# Altium project Recorder_ESP32.PrjPCB
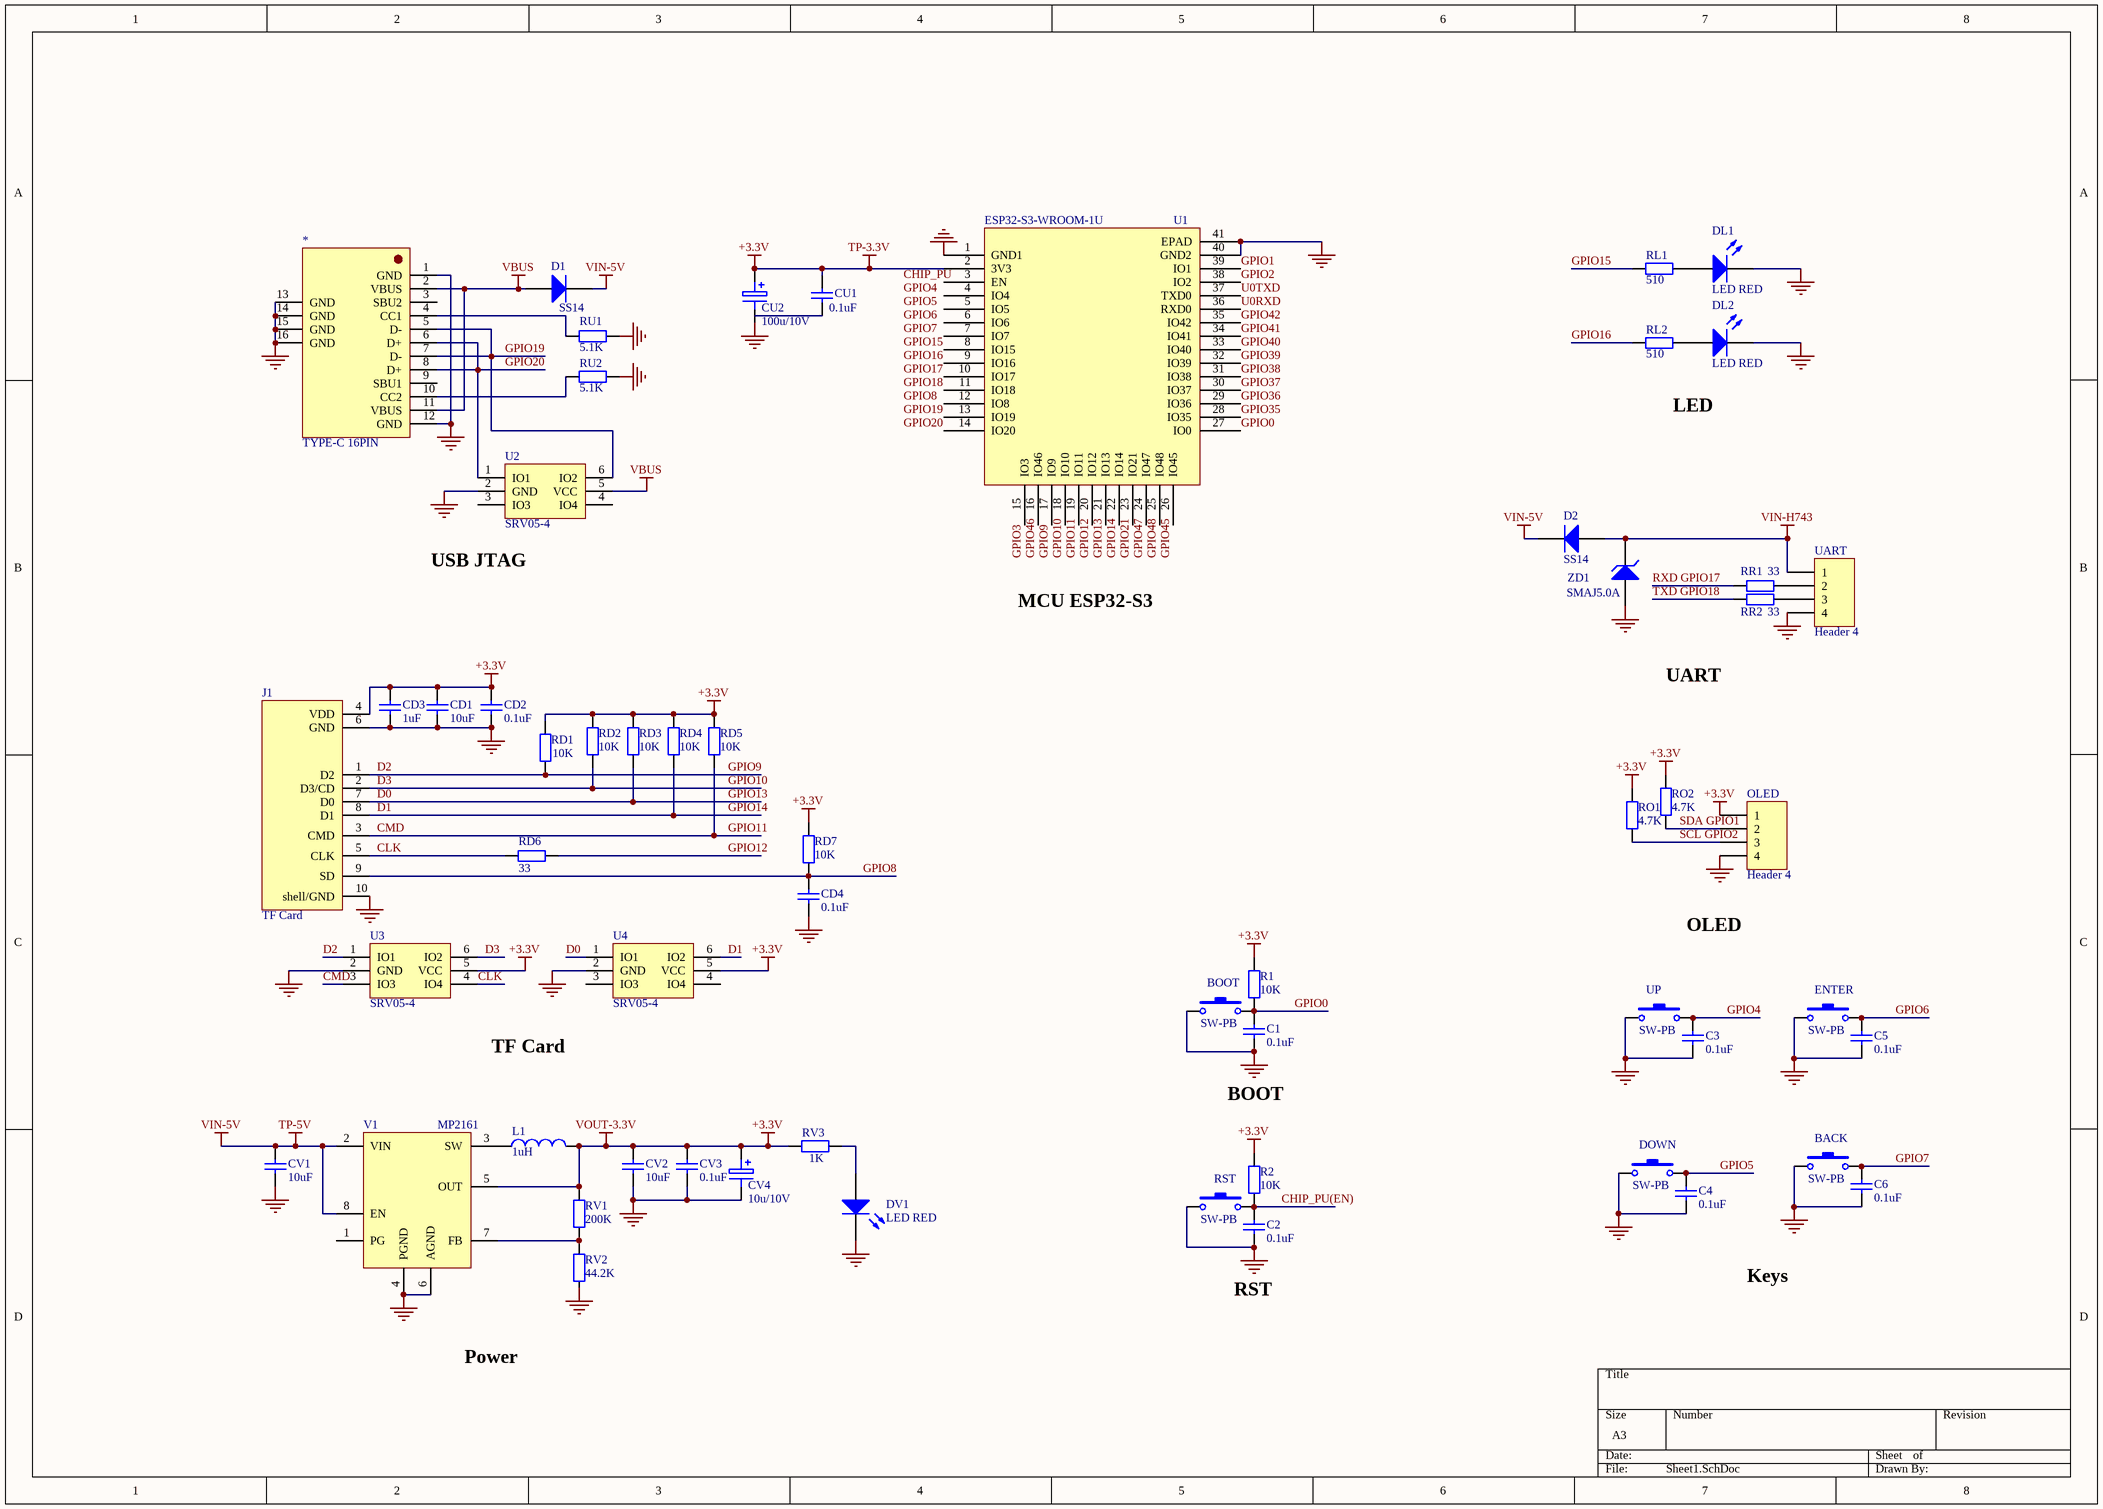
[diagram p0: Sheet1.SchDoc]
1 sheet, 58 parts. Net scope: global (net labels, ports and power ports of the same name join across sheets).
Board files: PCB1.PcbDoc, ZJ-20260608.PcbDoc

## Sheet Sheet1.SchDoc
size A3

### Parts
*  TYPE-C 16PIN
BACK  SW-PB  [SPST-2]
BOOT  SW-PB  [SPST-2]
C1  value 0.1uF  [RAD-0.3]  (hidden comment: Cap)
C2  value 0.1uF  [RAD-0.3]  (hidden comment: Cap)
C3  value 0.1uF  [RAD-0.3]  (hidden comment: Cap)
C4  value 0.1uF  [RAD-0.3]  (hidden comment: Cap)
C5  value 0.1uF  [RAD-0.3]  (hidden comment: Cap)
C6  value 0.1uF  [RAD-0.3]  (hidden comment: Cap)
CD1  value 10uF  [RAD-0.3]  (hidden comment: Cap)
CD2  value 0.1uF  [RAD-0.3]  (hidden comment: Cap)
CD3  value 1uF  [RAD-0.3]  (hidden comment: Cap)
CD4  value 0.1uF  [RAD-0.3]  (hidden comment: Cap)
CU1  value 0.1uF  [RAD-0.3]  (hidden comment: Cap)
CU2  100u/10V
CV1  value 10uF  [RAD-0.3]  (hidden comment: Cap)
CV2  value 10uF  [RAD-0.3]  (hidden comment: Cap)
CV3  value 0.1uF  [RAD-0.3]  (hidden comment: Cap)
CV4  10u/10V
D1  SS14  [SMC]
D2  SS14  [SMC]
DL1  LED RED  [3.2X1.6X1.1]
DL2  LED RED  [3.2X1.6X1.1]
DOWN  SW-PB  [SPST-2]
DV1  LED RED  [3.2X1.6X1.1]
ENTER  SW-PB  [SPST-2]
ESP32-S3-WROOM-1U  U1
J1  TF Card
L1  value 1uH  [0402-A]  (hidden comment: Inductor)
OLED  Header 4  [HDR1X4]
R1  value 10K  [AXIAL-0.4]  (hidden comment: Res2)
R2  value 10K  [AXIAL-0.4]  (hidden comment: Res2)
RD1  value 10K  [AXIAL-0.4]  (hidden comment: Res2)
RD2  value 10K  [AXIAL-0.4]  (hidden comment: Res2)
RD3  value 10K  [AXIAL-0.4]  (hidden comment: Res2)
RD4  value 10K  [AXIAL-0.4]  (hidden comment: Res2)
RD5  value 10K  [AXIAL-0.4]  (hidden comment: Res2)
RD6  value 33  [AXIAL-0.4]  (hidden comment: Res2)
RD7  value 10K  [AXIAL-0.4]  (hidden comment: Res2)
RL1  510  [AXIAL-0.4]
RL2  510  [AXIAL-0.4]
RO1  value 4.7K  [AXIAL-0.4]  (hidden comment: Res2)
RO2  value 4.7K  [AXIAL-0.4]  (hidden comment: Res2)
RR1  value 33  [AXIAL-0.4]  (hidden comment: Res2)
RR2  value 33  [AXIAL-0.4]  (hidden comment: Res2)
RST  SW-PB  [SPST-2]
RU1  5.1K  [AXIAL-0.4]
RU2  5.1K  [AXIAL-0.4]
RV1  value 200K  [AXIAL-0.4]  (hidden comment: Res2)
RV2  value 44.2K  [AXIAL-0.4]  (hidden comment: Res2)
RV3  1K  [AXIAL-0.4]
U2  SRV05-4
U3  SRV05-4
U4  SRV05-4
UART  Header 4  [HDR1X4]
UP  SW-PB  [SPST-2]
V1  MP2161
ZD1  SMAJ5.0A  [DIODE-0.7]

### Nets
+3.3V: CD1.2 CD2.2 CD3.2 CU1.2 CU2.1 CV2.2 CV3.2 CV4.1 ESP32-S3-WROOM-1U.2(3V3) J1.4(VDD) L1.2 OLED.1 R1.2 R2.2 RD1.2 RD2.2 RD3.2 RD4.2 RD5.2 RD7.2 RO1.2 RO2.2 RV1.2 RV3.2 U3.5(VCC) U4.5(VCC) V1.5(OUT)  [also labelled TP-3.3V, VOUT-3.3V]
GND: *.1(GND) *.12(GND) *.13(GND) *.14(GND) *.15(GND) *.16(GND) BACK.1 BOOT.1 C1.1 C2.1 C3.1 C4.1 C5.1 C6.1 CD1.1 CD2.1 CD3.1 CD4.1 CU2.2 CV1.1 CV2.1 CV3.1 CV4.2 DL1.2(K) DL2.2(K) DOWN.1 DV1.2(K) ENTER.1 ESP32-S3-WROOM-1U.1(GND1) ESP32-S3-WROOM-1U.40(GND2) ESP32-S3-WROOM-1U.41(EPAD) J1.6(GND) J1.10(shell/GND) OLED.4 RST.1 RU1.1 RU2.1 U2.2(GND) U3.2(GND) U4.2(GND) UART.4 UP.1 V1.4(PGND) V1.6(AGND) ZD1.1(A)
TP-5V: CV1.2 D1.2(K) D2.2(K) V1.2(VIN) V1.8(EN)  [also labelled VIN-5V]
VBUS: *.2(VBUS) *.11(VBUS) D1.1(A) U2.5(VCC)
VIN-H743: D2.1(A) UART.1 ZD1.2(K)
CHIP_PU(EN): C2.2 R2.1 RST.2
CLK: J1.5(CLK) RD6.2 U3.4(IO4)
CMD: J1.3(CMD) RD5.1 U3.3(IO3)  [also labelled GPIO11]
D0: J1.7(D0) RD3.1 U4.1(IO1)  [also labelled GPIO13]
D1: J1.8(D1) RD4.1 U4.6(IO2)  [also labelled GPIO14]
D2: J1.1(D2) RD1.1 U3.1(IO1)  [also labelled GPIO9]
D3: J1.2(D3/CD) RD2.1 U3.6(IO2)  [also labelled GPIO10]
GPIO0: BOOT.2 C1.2 ESP32-S3-WROOM-1U.27(IO0) R1.1
GPIO1: ESP32-S3-WROOM-1U.39(IO1)
GPIO2: ESP32-S3-WROOM-1U.38(IO2)
GPIO4: C3.2 UP.2
GPIO5: C4.2 DOWN.2
GPIO6: C5.2 ENTER.2
GPIO7: BACK.2 C6.2
GPIO8: CD4.2 J1.9(SD) RD7.1
GPIO12: RD6.1
GPIO15: RL1.2
GPIO16: RL2.2
GPIO19: *.5(D-) *.7(D-) U2.6(IO2)
GPIO20: *.6(D+) *.8(D+) U2.1(IO1)
GPIO35: ESP32-S3-WROOM-1U.28(IO35)
GPIO36: ESP32-S3-WROOM-1U.29(IO36)
GPIO37: ESP32-S3-WROOM-1U.30(IO37)
GPIO38: ESP32-S3-WROOM-1U.31(IO38)
GPIO39: ESP32-S3-WROOM-1U.32(IO39)
GPIO40: ESP32-S3-WROOM-1U.33(IO40)
GPIO41: ESP32-S3-WROOM-1U.34(IO41)
GPIO42: ESP32-S3-WROOM-1U.35(IO42)
RXD GPIO17: RR1.2
SCL GPIO2: OLED.3 RO1.1
SDA GPIO1: OLED.2 RO2.1
TXD GPIO18: RR2.2
U0RXD: ESP32-S3-WROOM-1U.36(RXD0)
U0TXD: ESP32-S3-WROOM-1U.37(TXD0)
Net*_4: *.4(CC1) RU1.2
Net*_10: *.10(CC2) RU2.2
NetDL1_1: DL1.1(A) RL1.1
NetDL2_1: DL2.1(A) RL2.1
NetDV1_1: DV1.1(A) RV3.1
NetL1_1: L1.1 V1.3(SW)
NetRR1_1: RR1.1 UART.2
NetRR2_1: RR2.1 UART.3
NetRV1_1: RV1.1 RV2.2 V1.7(FB)

Not connected (* = marked no-connect by the designer): * 3(SBU2) 9(SBU1); CU1 1; ESP32-S3-WROOM-1U 3(EN) 4(IO4) 5(IO5) 6(IO6) 7(IO7) 8(IO15) 9(IO16) 10(IO17) 11(IO18) 12(IO8) 13(IO19) 14(IO20) 15(IO3) 16(IO46) 17(IO9) 18(IO10) 19(IO11) 20(IO12) 21(IO13) 22(IO14) 23(IO21) 24(IO47) 25(IO48) 26(IO45); RV2 1; U2 3(IO3) 4(IO4); U4 3(IO3) 4(IO4); V1 1(PG)

### Notes on the sheet
- LED
- (near U2) USB JTAG
- MCU ESP32-S3
- UART
- OLED
- TF Card
- BOOT
- RST
- Keys
- Power
- Labels drawn without touching a wire or pin: CHIP_PU, GND, GPIO3, GPIO4, GPIO5, GPIO6, GPIO7, GPIO8, GPIO9, GPIO10, GPIO11, GPIO12, GPIO13, GPIO14, GPIO15, GPIO16, GPIO17, GPIO18, GPIO19, GPIO20, GPIO21, GPIO45, GPIO46, GPIO47, GPIO48

### Library data of the parts
BACK BOOT DOWN ENTER RST UP = SW-PB: Switch; Published: 24-Mar-1999; LatestRevisionDate: 17-Jul-2002; LatestRevisionNote: Re-released for DXP Platform.; PackageReference: SPST-2; Publisher: Altium Limited
C1-C6 CD1-CD4 CU1 CV1-CV3 = Cap: Capacitor; Published: 8-Jun-2000; LatestRevisionDate: 17-Jul-2002; LatestRevisionNote: Re-released for DXP Platform.; PackageReference: RAD-0.3; Publisher: Altium Limited; PackageDescription: Radial Cap, Thru-Hole; 2 Leads; 0.3 in Pin Spacing
CU2 CV4 = ELECTRO1: Electrolytic Capacitor
D1 D2 = Diode: Default Diode; Published: 8-Jun-2000; LatestRevisionDate: 17-Jul-2002; LatestRevisionNote: Re-released for DXP Platform.; PackageVersion: Sep-1996; PackageReference: SMC; Publisher: Altium Limited; PackageDescription: DO-214-AB/SMC; 2 C-Bend Leads; Body 7.9 x 5.9 mm, inc. leads (LxW); Code_JEDEC: DO-214-AB
DL1 DL2 DV1 = LED2: Typical RED, GREEN, YELLOW, AMBER GaAs LED; Published: 8-Jun-2000; LatestRevisionDate: 17-Jul-2002; LatestRevisionNote: Re-released for DXP Platform.; PackageVersion: Feb-2002; PackageReference: 3.2X1.6X1.1; Publisher: Altium Limited; PackageDescription: SM LED; 2 Flat Leads
ESP32-S3-WROOM-1U = ESP32-S3-WROOM-1U
L1 = Inductor: Code_IEC: 1005; Published: 8-Jun-2000; LatestRevisionDate: 29-May-2009; LatestRevisionNote: IPC-7351 Footprint Added.; PackageReference: 0402-A; Publisher: Altium Limited; PackageDescription: Chip Inductor; Code_JEITA: 0402
OLED UART = Header 4: Header, 4-Pin; LatestRevisionDate: 17-Jul-2002; LatestRevisionNote: Re-released for DXP Platform.; Publisher: Altium Limited
R1 R2 RD1-RD7 RL1 RL2 RO1 RO2 RR1 RR2 RU1 RU2 RV1-RV3 = Res2: Resistor; Published: 8-Jun-2000; LatestRevisionDate: 17-Jul-2002; LatestRevisionNote: Re-released for DXP Platform.; PackageReference: AXIAL-0.4; Publisher: Altium Limited; PackageDescription: Axial Device, Thru-Hole; 2 Leads; 0.4 in Pin Spacing
  RL1 RL2: Value: 510
  RU1 RU2: Value: 5.1K
  RV3: Value: 1K
ZD1 = D Zener: Zener Diode; Published: 8-Jun-2000; LatestRevisionDate: 17-Jul-2002; LatestRevisionNote: Re-released for DXP Platform.; PackageReference: DIODE-0.7; Publisher: Altium Limited